# Altium schematic sheet PMOD_CAN.SchDoc: CAN Bus Schnittstelle
size A4; SheetNumber: 1; SheetTotal: 1
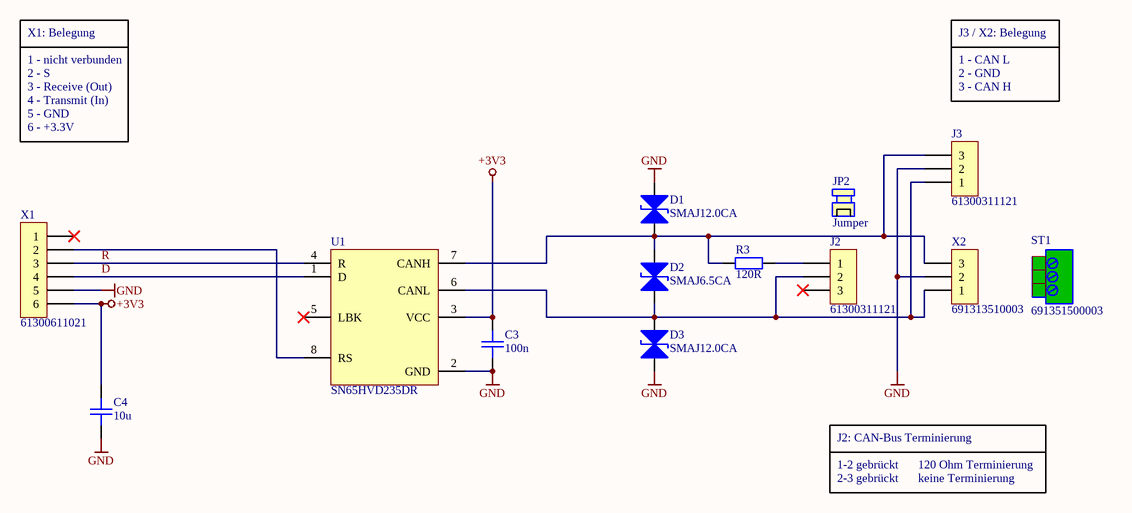
[diagram p0: PMOD_CAN.SchDoc]

## Parts
C3  100n  [0805-C]
C4  10u  [0805-C]
D1  SMAJ12.0CA  [SMA-BIDIRECTIONAL]
D2  SMAJ6.5CA  [SMA-BIDIRECTIONAL]
D3  SMAJ12.0CA  [SMA-BIDIRECTIONAL]
J2  61300311121  [WE-61300311121]
J3  61300311121  [WE-61300311121]
JP2  Jumper  (mechanical)
R3  120R  [1206-R]
ST1  691351500003  (mechanical)
U1  SN65HVD235DR  [SOIC-8]
X1  61300611021  [WE-61302021121]
X2  691313510003  [WE-691313510003]

## Nets
+3V3: C3.1 C4.2 U1.3(VCC) X1.6
GND: C3.2 C4.1 D1.1(A1) D3.2(A2) J3.2 U1.2(GND) X1.5 X2.2
D: U1.1(D) X1.4
R: U1.4(R) X1.3
NetD1_2: D1.2(A2) D2.1(A1) J3.3 R3.1 U1.7(CANH) X2.3
NetD2_2: D2.2(A2) D3.1(A1) J2.2 J3.1 U1.6(CANL) X2.1
NetJ2_1: J2.1 R3.2
NetU1_8: U1.8(RS) X1.2

Not connected (* = marked no-connect by the designer): J2 3*; U1 5(LBK)*; X1 1*

## Notes on the sheet
- X1: Belegung
- 1 - nicht verbunden
- 2 - S
- J3 / X2: Belegung
- 1 - CAN L
- 2 - GND
- 3 - Receive (Out)
- 4 - Transmit (In)
- 5 - GND
- 6 - +3.3V
- 3 - CAN H
- J2: CAN-Bus Terminierung
- 1-2 gebrückt
- 2-3 gebrückt
- 120 Ohm Terminierung
- keine Terminierung
- Gezeichnet von
- am
- Projekt
- ibs
- Geprüft von
- Nummer
- Titel
- Variante
- Revision
- Grösse
- Status
- Datei
- Blatt
- Blätter
- A4
- Weitergabe, sowie Vervielfältigung dieser Unterlage, Verwertung und Mitteilung ihres Inhaltes nicht gestattet, soweit nicht ausdrücklich schriftlich zugestanden. Alle Rechte vorbehalten.
- IBS-Systemtechnik
  Wettersteinstrasse 14
  D-82481 Mittenwald

## Library data of the parts
C3 = Capacitor 100n 0805: CAP CER 0.1UF 50V X8R 0805; Manufacturer PartNo: GCM21BR91H104KA37L; Manufacturer: Murata Electronics; Supplier 1 (Info): Digi-Key; Supplier 1 PartNo (Info): 490-11165-1-ND
C4 = Capacitor 10u 0805: CAP CER 10UF 16V X5R 0805; Manufacturer PartNo: EMK212BBJ106KGHT; Manufacturer: Taiyo Yuden; Supplier 1 (Info): Digi-Key; Supplier 1 PartNo (Info): 587-3320-1-ND
D1 D3 = Diode TVS SMAJ12.0CA: TVS DIODE 12V 19.9V DO214AC; Manufacturer PartNo: SMAJ12CA-TP; Manufacturer: Micro Commercial Co; Supplier 1 (Info): Digi-Key; Supplier 1 PartNo (Info): SMAJ12CA-TPMSCT-ND
D2 = Diode TVS SMAJ6.5CA: TVS DIODE 6.5V 11.2V DO214AC; Manufacturer PartNo: SMAJ6.5CA-TP; Manufacturer: Micro Commercial Co; Supplier 1 (Info): Digi-Key; Supplier 1 PartNo (Info): SMAJ6.5CA-TPMSCT-ND
J2 J3 = WE 61300311121: CONN HEADER VERT 3POS 2.54MM; Manufacturer: Würth Elektronik; Manufacturer PartNo: 61300311121; Supplier 1 (Info): Digi-Key; Supplier 1 PartNo (Info): 732-5316-ND
JP2 = Jumper: JUMPER W/TEST PNT 1X2PINS 2.54MM; Manufacturer: Würth Elektronik; Manufacturer PartNo: 60900213421; Supplier 1 (Info): Digi-Key; Supplier 1 PartNo (Info): 732-2678-ND
R3 = Resistor 120R 1206: RES SMD 120 OHM 1% 1/4W 1206; Manufacturer: Yageo; Manufacturer PartNo: RC1206FR-07120RL; Supplier 1 (Info): Digi-Key; Supplier 1 PartNo (Info): 311-120FRCT-ND
ST1 = Plug WE 691351500003: TERM BLOCK PLUG 3POS 5.08MM; Manufacturer: Würth Elektronik; Manufacturer PartNo: 691351500003; Supplier 1 (Info): Digi-Key; Supplier 1 PartNo (Info): 732-2041-ND
U1 = SN65HVD235DR SOIC8: IC TRANSCEIVER HALF 1/1 8SOIC; Manufacturer: Texas Instruments; Manufacturer PartNo: SN65HVD235DR; Supplier 1 (Info): Digi-Key; Supplier 1 PartNo (Info): 296-44789-1-ND
X1 = PMOD Plug 6X1: CONN HEADER R/A 6POS 2.54MM; Manufacturer: Würth Elektronik; Manufacturer PartNo: 61300611021; Supplier 1 (Info): Digi-Key; Supplier 1 PartNo (Info): 732-5339-ND
X2 = WE 691313510003: TERM BLOCK HDR 3POS 90DEG 5.08MM; Manufacturer: Würth Elektronik; Manufacturer PartNo: 691313510003; Supplier 1 (Info): Digi-Key; Supplier 1 PartNo (Info): 732-2071-ND